# Altium project Extension_Board.PrjPcb
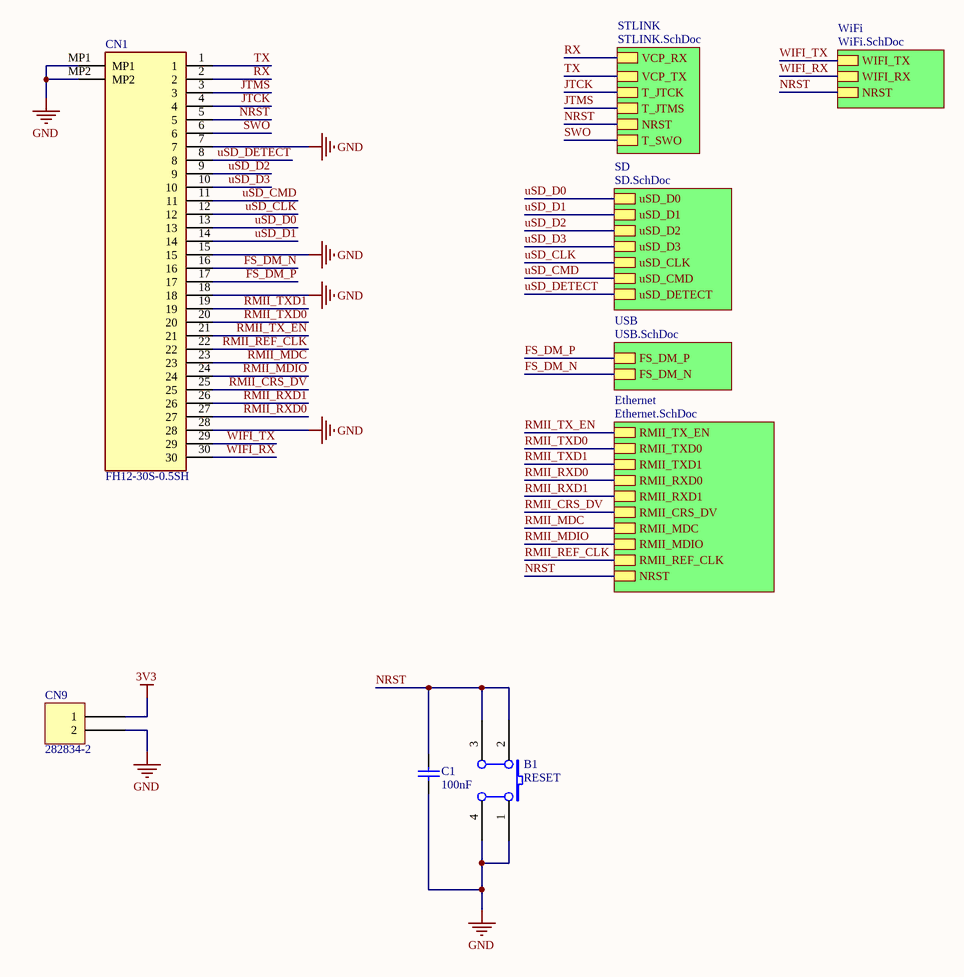
[diagram p0: Extension_Board.SchDoc]
6 sheets, 134 parts. Net scope: hierarchical (ports join the sheet entries above them; power ports are global).
Board files: PCB.PcbDoc, PCB_Auto.PcbDoc
Sheets:
  Extension_Board.SchDoc
    STLINK = STLINK.SchDoc
    SD = SD.SchDoc
    USB = USB.SchDoc
    Ethernet = Ethernet.SchDoc
    WiFi = WiFi.SchDoc

## Sheet Extension_Board.SchDoc
size B

### Parts
B1  RESET  [PB-6X6mm-Blue]
C1  value 100nF  [1608[0603]]  (hidden comment: Cap)
CN1  FH12-30S-0.5SH  [FH1230S05SH]
CN9  282834-2  [TE 282834-2]

### Sub-sheets
Ethernet = Ethernet.SchDoc: RMII_TX_EN, RMII_TXD0, RMII_TXD1, RMII_RXD0, RMII_RXD1, RMII_CRS_DV, RMII_MDC, RMII_MDIO, RMII_REF_CLK, NRST
SD = SD.SchDoc: uSD_D0, uSD_D1, uSD_D2, uSD_D3, uSD_CLK, uSD_CMD, uSD_DETECT
STLINK = STLINK.SchDoc: VCP_RX, VCP_TX, T_JTCK, T_JTMS, NRST, T_SWO
USB = USB.SchDoc: FS_DM_P, FS_DM_N
WiFi = WiFi.SchDoc: WIFI_TX, WIFI_RX, NRST

### Nets
3V3: CN9.1
GND: B1.1(A0) B1.4(A1) C1.2 CN1.7 CN1.15 CN1.18 CN1.28 CN1.MP1 CN1.MP2 CN9.2
FS_DM_N: CN1.16 ; sheet USB/FS_DM_N
FS_DM_P: CN1.17 ; sheet USB/FS_DM_P
JTCK: CN1.4 ; sheet STLINK/T_JTCK
JTMS: CN1.3 ; sheet STLINK/T_JTMS
NRST: B1.2(B0) B1.3(B1) C1.1 CN1.5 ; sheet STLINK/NRST, sheet Ethernet/NRST, sheet WiFi/NRST
RMII_CRS_DV: CN1.25 ; sheet Ethernet/RMII_CRS_DV
RMII_MDC: CN1.23 ; sheet Ethernet/RMII_MDC
RMII_MDIO: CN1.24 ; sheet Ethernet/RMII_MDIO
RMII_REF_CLK: CN1.22 ; sheet Ethernet/RMII_REF_CLK
RMII_RXD0: CN1.27 ; sheet Ethernet/RMII_RXD0
RMII_RXD1: CN1.26 ; sheet Ethernet/RMII_RXD1
RMII_TX_EN: CN1.21 ; sheet Ethernet/RMII_TX_EN
RMII_TXD0: CN1.20 ; sheet Ethernet/RMII_TXD0
RMII_TXD1: CN1.19 ; sheet Ethernet/RMII_TXD1
RX: CN1.2 ; sheet STLINK/VCP_RX
SWO: CN1.6 ; sheet STLINK/T_SWO
TX: CN1.1 ; sheet STLINK/VCP_TX
uSD_CLK: CN1.12 ; sheet SD/uSD_CLK
uSD_CMD: CN1.11 ; sheet SD/uSD_CMD
uSD_D0: CN1.13 ; sheet SD/uSD_D0
uSD_D1: CN1.14 ; sheet SD/uSD_D1
uSD_D2: CN1.9 ; sheet SD/uSD_D2
uSD_D3: CN1.10 ; sheet SD/uSD_D3
uSD_DETECT: CN1.8 ; sheet SD/uSD_DETECT
WIFI_RX: CN1.30 ; sheet WiFi/WIFI_RX  [project net RXD0]
WIFI_TX: CN1.29 ; sheet WiFi/WIFI_TX  [project net TXD0]

### Library data of the parts
B1 = SW PUSHBUTTON: SE PUSHBUTTON
C1 = Cap: Capacitor; Published: 8-Jun-2000; LatestRevisionDate: 17-Jul-2002; LatestRevisionNote: Re-released for DXP Platform.; PackageReference: RAD-0.3; Publisher: Altium Limited; PackageDescription: Radial Cap, Thru-Hole; 2 Leads; 0.3 in Pin Spacing
CN1 = FH12-30S-0.5SH: Connector; Manufacturer_Name: Hirose; Datasheet Link: https://datasheet.datasheetarchive.com/originals/dk/DKDS-2/23451.pdf; Height: 4.8mm; Manufacturer_Part_Number: FH12-30S-0.5SH
CN9 = 282834-2: TERM BLK 2P SIDE ENT 2.54MM PCB; Manufacturer: TE Connectivity AMP Connectors; Current: 10A; Mating Orientation: Horizontal with Board; Number of Levels: 1; Pitch: 0.100" (2.54mm); Positions Per Level: 2; Voltage: 150V; Wire Gauge: 16-30 AWG; Wire Termination: Screw - Rising Cage Clamp; Part Number: 282834-2; Color: Green; ComponentLink1Description: Datasheet; ComponentLink1URL: https://www.te.com/commerce/DocumentDelivery/DDEController?Action=srchrtrv&DocNm=282834&DocType=Customer+Drawing&DocLang=English; ComponentLink2Description: DigiKey Link; ComponentLink2URL: http://digikey.com/product-detail/en/te-connectivity-amp-connectors/282834-2/A98333-ND/1150135; LastUpdated: 1/15/2020 4:15:38 AM; Lifecycle Status: Active; Minimum Order: 1; Mounting Type: Through Hole; Packaging: Bulk; Part Status: Active; Price: 0.88; Series: Buchanan; Supplier 1: DigiKey; Supplier Part Number 1: A98333-ND

## Sheet STLINK.SchDoc
size B
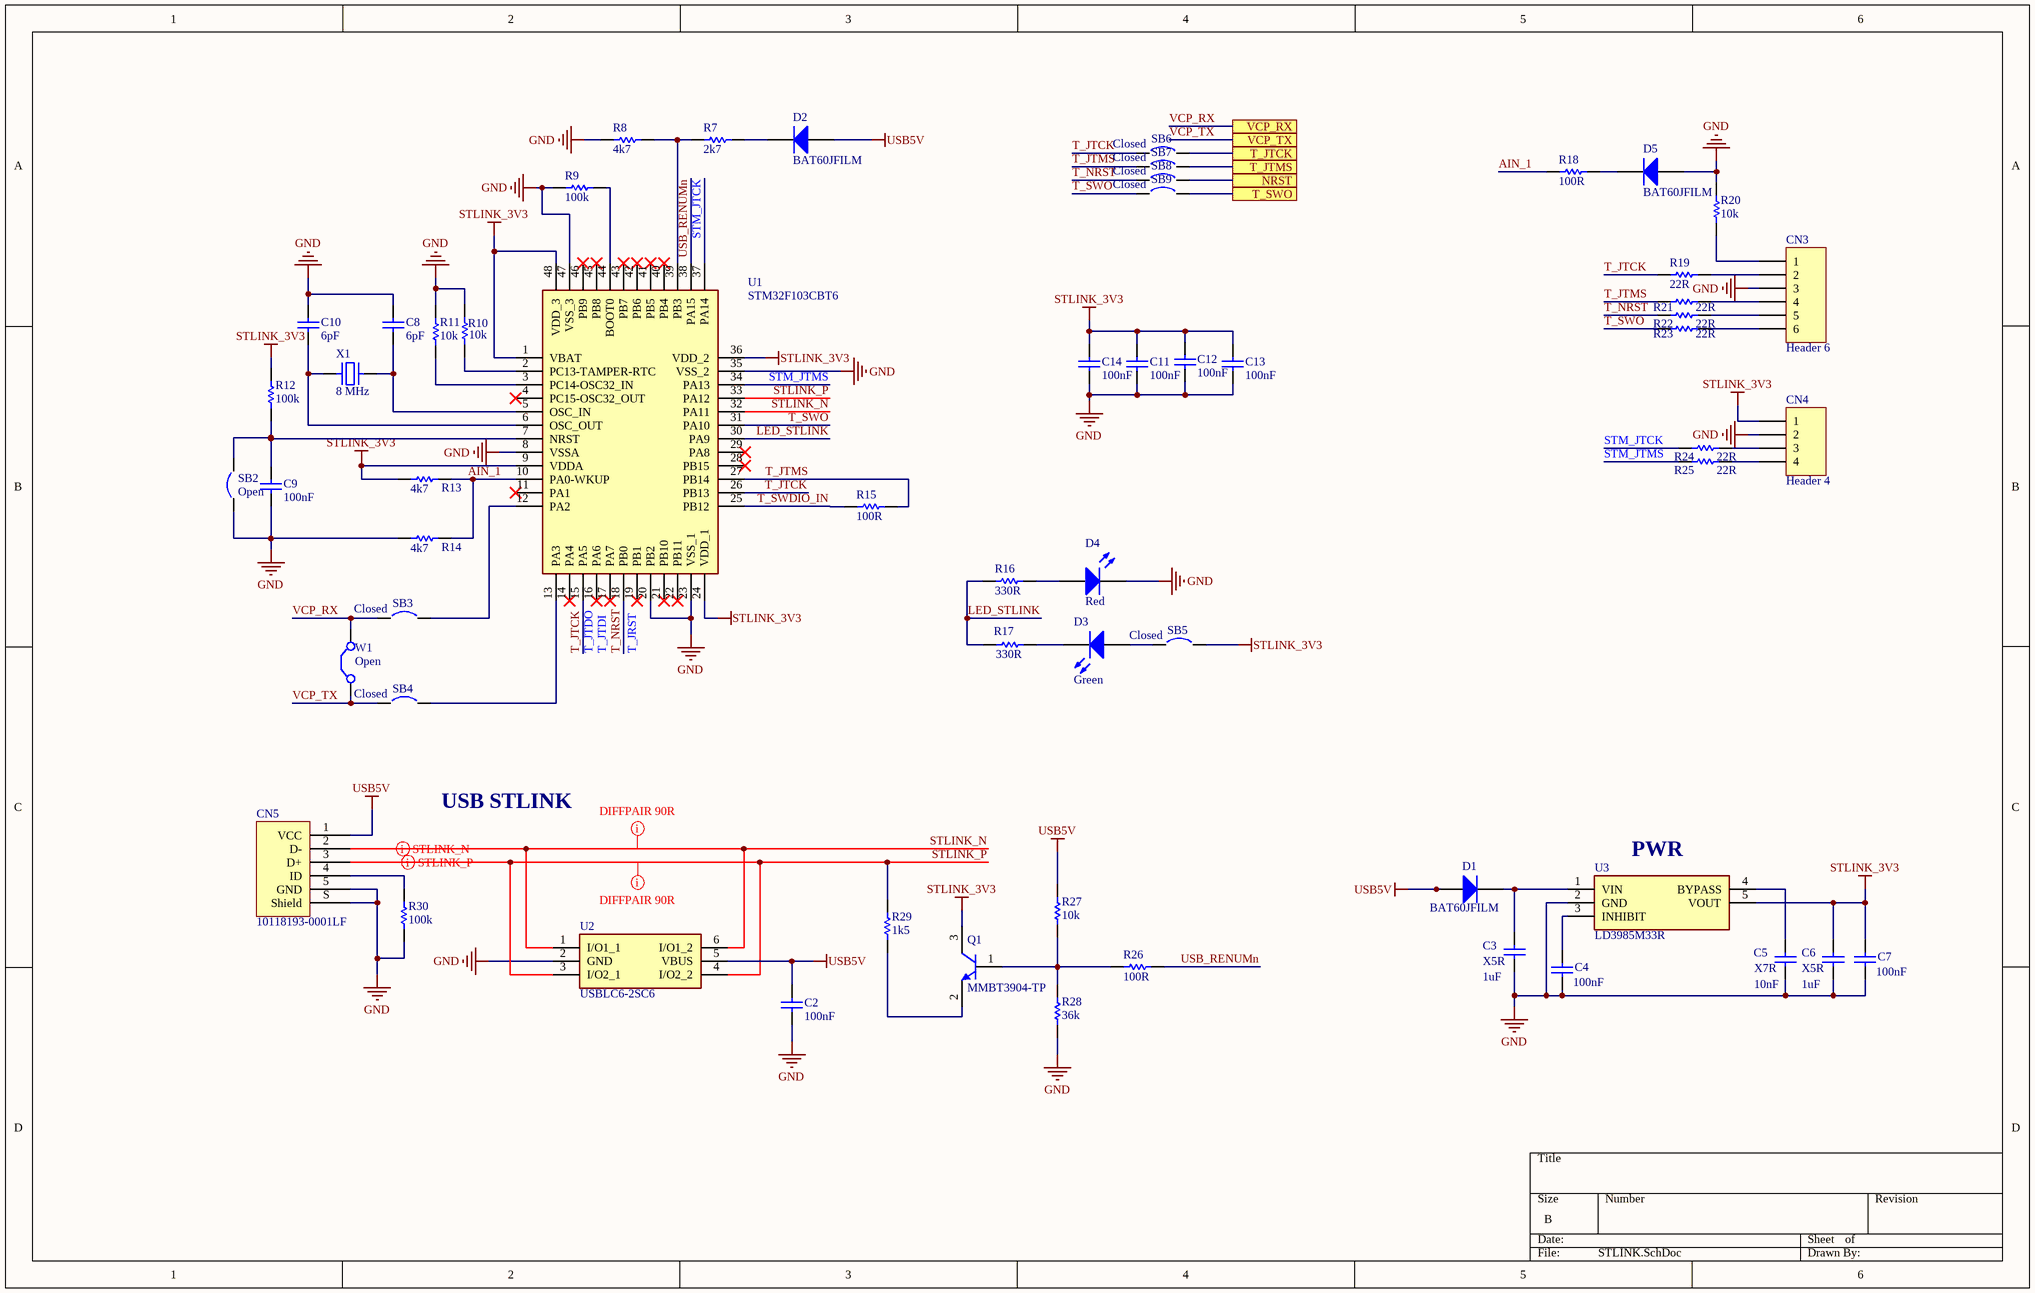
[diagram p1: STLINK.SchDoc]

### Parts
C2  value 100nF  [1608[0603]]  (hidden comment: Cap)
C3  X5R  value 1uF  [1608[0603]]
C4  value 100nF  [1608[0603]]  (hidden comment: X5R)
C5  X7R  value 10nF  [1608[0603]]
C6  X5R  value 1uF  [1608[0603]]
C7  value 100nF  [1608[0603]]  (hidden comment: X5R)
C8  value 6pF  [1608[0603]]  (hidden comment: Cap)
C9  value 100nF  [1608[0603]]  (hidden comment: Cap)
C10  value 6pF  [1608[0603]]  (hidden comment: Cap)
C11  value 100nF  [1608[0603]]  (hidden comment: Cap)
C12  value 100nF  [1608[0603]]  (hidden comment: Cap)
C13  value 100nF  [1608[0603]]  (hidden comment: Cap)
C14  value 100nF  [1608[0603]]  (hidden comment: Cap)
CN3  Header 6  [HDR1X6]
CN4  Header 4  [HDR1X4]
CN5  10118193-0001LF  [FCI USB 10118193-0001LF]
D1  BAT60JFILM  [C0805]
D2  BAT60JFILM  [C0805]
D3  Green  [1608[0603]]
D4  Red  [1608[0603]]
D5  BAT60JFILM  [C0805]
Q1  MMBT3904-TP  [MCCSEMI SOT-23-3]
R7  value 2k7  [1608[0603]]  (hidden comment: Res1)
R8  value 4k7  [1608[0603]]  (hidden comment: Res1)
R9  value 100k  [1608[0603]]  (hidden comment: Res1)
R10  value 10k  [1608[0603]]  (hidden comment: Res1)
R11  value 10k  [1608[0603]]  (hidden comment: Res1)
R12  value 100k  [1608[0603]]  (hidden comment: Res1)
R13  value 4k7  [1608[0603]]  (hidden comment: Res1)
R14  value 4k7  [1608[0603]]  (hidden comment: Res1)
R15  value 100R  [1608[0603]]  (hidden comment: Res1)
R16  value 330R  [1608[0603]]  (hidden comment: Res1)
R17  value 330R  [1608[0603]]  (hidden comment: Res1)
R18  value 100R  [1608[0603]]  (hidden comment: Res1)
R19  value 22R  [1608[0603]]  (hidden comment: Res1)
R20  value 10k  [1608[0603]]  (hidden comment: Res1)
R21  value 22R  [1608[0603]]  (hidden comment: Res1)
R22  value 22R  [1608[0603]]  (hidden comment: Res1)
R23  value 22R  [1608[0603]]  (hidden comment: Res1)
R24  value 22R  [1608[0603]]  (hidden comment: Res1)
R25  value 22R  [1608[0603]]  (hidden comment: Res1)
R26  value 100R  [1608[0603]]  (hidden comment: Res1)
R27  value 10k  [1608[0603]]  (hidden comment: Res1)
R28  value 36k  [1608[0603]]  (hidden comment: Res1)
R29  value 1k5  [1608[0603]]  (hidden comment: Res1)
R30  value 100k  [1608[0603]]  (hidden comment: Res1)
SB2  Open  [SB_0603]
SB3  Closed  [SB_0603]
SB4  Closed  [SB_0603]
SB5  Closed  [SB_0603]
SB6  Closed  [SB_0603]
SB7  Closed  [SB_0603]
SB8  Closed  [SB_0603]
SB9  Closed  [SB_0603]
U1  STM32F103CBT6  [QFP50P900X900X160-48N]
U2  USBLC6-2SC6  [SOT95P280X145-6N]
U3  LD3985M33R  [SOT95P280X145-5N]
W1  Open  [HDR1X2]
X1  8 MHz  [ECS CSM-3X]

### Ports
NRST, T_JTCK, T_JTMS, T_SWO, VCP_RX, VCP_TX

### Nets
GND: C2.1 C3.1 C4.2 C5.1 C6.1 C7.2 C8.2 C9.1 C10.2 C11.1 C12.1 C13.1 C14.1 CN3.3 CN4.2 CN5.5(GND) CN5.S(Shield) D4.2(K) D5.1(A) R8.2 R9.2 R10.2 R11.1 R14.2 R20.1 R28.1 R30.1 SB2.1 U1.8(VSSA) U1.20(PB2) U1.23(VSS_1) U1.35(VSS_2) U1.47(VSS_3) U2.2(GND) U3.2(GND)
STLINK_3V3: C6.2 C7.1 C11.2 C12.2 C13.2 C14.2 CN4.1 Q1.3(C) R12.2 R13.2 SB5.2 U1.1(VBAT) U1.9(VDDA) U1.24(VDD_1) U1.36(VDD_2) U1.48(VDD_3) U3.5(VOUT)
USB5V: C2.2 CN5.1(VCC) D1.1(A) D2.1(A) R27.2 U2.5(VBUS)
AIN_1: R13.1 R14.1 R18.1 U1.10(PA0-WKUP)
JTCK: SB6.2 ; port T_JTCK
JTMS: SB7.2 ; port T_JTMS
LED_STLINK: R16.2 R17.2 U1.30(PA9)
NRST: SB8.2 ; port NRST
STLINK_N: CN5.2(D-) U1.32(PA11) U2.1(I/O1_1) U2.6(I/O1_2)
STLINK_P: CN5.3(D+) R29.2 U1.33(PA12) U2.3(I/O2_1) U2.4(I/O2_2)
STM_JTCK: R24.1 U1.37(PA14)
STM_JTMS: R25.1 U1.34(PA13)
SWO: SB9.2 ; port T_SWO
T_JRST: R22.1 SB8.1 U1.18(PB0)  [also labelled T_NRST]
T_JTCK: R19.1 SB6.1 U1.15(PA5) U1.26(PB13)
T_JTMS: R15.1 R21.1 SB7.1 U1.27(PB14)
T_SWDIO_IN: R15.2 U1.25(PB12)
T_SWO: R23.1 SB9.1 U1.31(PA10)
USB_RENUMn: R26.1 U1.38(PA15)
VCP_RX: SB3.1 W1.2(C2) ; port VCP_RX  [project net RX]
VCP_TX: SB4.1 W1.1(C1) ; port VCP_TX  [project net TX]
NetC3_2: C3.2 D1.2(K) U3.1(VIN)
NetC4_1: C4.1 U3.3(INHIBIT)
NetC5_2: C5.2 U3.4(BYPASS)
NetC8_1: C8.1 U1.5(OSC_IN) X1.2
NetC9_2: C9.2 R12.1 SB2.2 U1.7(NRST)
NetC10_1: C10.1 U1.6(OSC_OUT) X1.1
NetCN3_1: CN3.1 R20.2
NetCN3_2: CN3.2 R19.2
NetCN3_4: CN3.4 R21.2
NetCN3_5: CN3.5 R22.2
NetCN3_6: CN3.6 R23.2
NetCN4_3: CN4.3 R24.2
NetCN4_4: CN4.4 R25.2
NetCN5_4: CN5.4(ID) R30.2
NetD2_2: D2.2(K) R7.1
NetD3_1: D3.1(A) SB5.1
NetD3_2: D3.2(K) R17.1
NetD4_1: D4.1(A) R16.1
NetD5_2: D5.2(K) R18.2
NetQ1_1: Q1.1(B) R26.2 R27.1 R28.2
NetQ1_2: Q1.2(E) R29.1
NetR7_2: R7.2 R8.1 U1.39(PB3)
NetR9_1: R9.1 U1.44(BOOT0)
NetR10_1: R10.1 U1.2(PC13-TAMPER-RTC)
NetR11_2: R11.2 U1.3(PC14-OSC32_IN)
NetSB3_2: SB3.2 U1.12(PA2)
NetSB4_2: SB4.2 U1.13(PA3)

Not connected (* = marked no-connect by the designer): U1 4(PC15-OSC32_OUT)* 11(PA1)* 14(PA4)* 16(PA6)* 17(PA7)* 19(PB1)* 21(PB10)* 22(PB11)* 28(PB15)* 29(PA8)* 40(PB4)* 41(PB5)* 42(PB6)* 43(PB7)* 45(PB8)* 46(PB9)*

### Layout directives
differential pair: STLINK_N, STLINK_P
mark named DIFFPAIR 90R: STLINK_N, STLINK_P

### Notes on the sheet
- USB STLINK
- (near U3) PWR
- Labels drawn without touching a wire or pin: T_JTDI, T_JTDO

### Library data of the parts
C2-C14 = Cap: Capacitor; Published: 8-Jun-2000; LatestRevisionDate: 17-Jul-2002; LatestRevisionNote: Re-released for DXP Platform.; PackageReference: RAD-0.3; Publisher: Altium Limited; PackageDescription: Radial Cap, Thru-Hole; 2 Leads; 0.3 in Pin Spacing
CN3 = Header 6: Header, 6-Pin; LatestRevisionDate: 17-Jul-2002; LatestRevisionNote: Re-released for DXP Platform.; Publisher: Altium Limited
CN4 = Header 4: Header, 4-Pin; LatestRevisionDate: 17-Jul-2002; LatestRevisionNote: Re-released for DXP Platform.; Publisher: Altium Limited
CN5 = 10118193-0001LF: CONN RCPT USB2.0 MICRO B SMD R/A; Manufacturer: Amphenol ICC (FCI); Connector Type: USB - micro B; Current Rating (Amps): 1.8A per Contact; Gender: Receptacle; Mating Cycles: 10000; Number of Contacts: 5; Number of Ports: 1; Shielding: Shielded; Voltage - Rated: 100VAC; Part Number: 10118193-0001LF; ComponentLink1Description: Datasheet; ComponentLink1URL: https://cdn.amphenol-icc.com/media/wysiwyg/files/documentation/datasheet/inputoutput/io_usb_micro.pdf; ComponentLink2Description: DigiKey Link; ComponentLink2URL: //digikey.com/product-detail/en/amphenol-icc-fci/10118193-0001LF/609-4616-2-ND/2785388; Features: Solder Retention; LastUpdated: 12/9/2019 8:51:28 PM; Lifecycle Status: 0; Minimum Order: 1; Mounting Feature: Horizontal; Mounting Type: Surface Mount, Right Angle; Through Hole; Operating Temperature: -30°C ~ 80°C; Packaging: TapeAndReel; Part Status: Active; Price: 0.21; Series: -; Specifications: USB 2.0; Supplier 1: DigiKey; Supplier Part Number 1: 609-4616-2-ND; Termination: Solder
D1 D2 D5 = Diode: Default Diode; Published: 8-Jun-2000; LatestRevisionDate: 17-Jul-2002; LatestRevisionNote: Re-released for DXP Platform.; PackageVersion: Sep-1996; PackageReference: SMC; Publisher: Altium Limited; PackageDescription: DO-214-AB/SMC; 2 C-Bend Leads; Body 7.9 x 5.9 mm, inc. leads (LxW); Code_JEDEC: DO-214-AB
D3 D4 = LED3: Typical BLUE SiC LED; Published: 8-Jun-2000; LatestRevisionDate: 17-Dec-2003; LatestRevisionNote: PCB Footprint replaced.; DatasheetVersion: 16-Apr-2002; PackageVersion: 16-Apr-2002; PackageReference: 3.5X2.8X1.9; Publisher: Altium Limited; PackageDescription: SM LED; 2 C-Bend Leads; Body 3.5 x 2.8 x 1.9 mm, inc leads (LxWxH typ)
Q1 = MMBT3904-TP: TRANS NPN 40V 0.2A SOT23; Manufacturer: Micro Commercial Co; Current - Collector Cutoff (Max): 50nA (ICBO); Current - Collector (Ic) (Max): 200 mA; DC Current Gain (hFE) (Min) @ Ic, Vce: 100 @ 10mA, 1V; Frequency - Transition: 300MHz; Power - Max: 350 mW; Vce Saturation (Max) @ Ib, Ic: 300mV @ 5mA, 50mA; Part Number: MMBT3904-TP; ComponentLink1Description: Datasheet; ComponentLink1URL: https://www.mccsemi.com/pdf/Products/MMBT3904(SOT-23).pdf; ComponentLink2Description: DigiKey Link; ComponentLink2URL: https://www.digikey.com/en/products/detail/micro-commercial-co/MMBT3904-TP/717280; LastUpdated: 2/3/2023 9:11:21 PM; Lifecycle Status: Active; Minimum Order: 1; Mounting Type: Surface Mount; Operating Temperature: -55°C ~ 150°C (TJ); Package / Case: TO-236-3, SC-59, SOT-23-3; Packaging: TapeAndReel; PartId: 260; Part Status: Active; Price: 0.01; Series: -; Supplier 1: DigiKey; Supplier Part Number 1: MMBT3904TPMSCT-ND; Supplier Device Package: SOT-23; Transistor Type: NPN; Voltage - Collector Emitter Breakdown (Max): 40 V
R7-R30 = Res1: Resistor; Published: 8-Jun-2000; LatestRevisionDate: 17-Jul-2002; LatestRevisionNote: Re-released for DXP Platform.; PackageReference: AXIAL-0.3; Publisher: Altium Limited; PackageDescription: Axial Device, Thru-Hole; 2 Leads; 0.3 in Pin Spacing
SB2-SB9 = Circuit Breaker: Published: 24-Mar-1999; Revision: July-2002: Re-released for DXP Platform.; Publisher: Altium Limited
U1 = STM32F103CBT6: Integrated Circuit; Manufacturer_Name: STMicroelectronics; Datasheet Link: http://www.st.com/st-web-ui/static/active/en/resource/technical/document/datasheet/CD00161566.pdf; Height: 1.6mm; Manufacturer_Part_Number: STM32F103CBT6; Mouser Part Number: 511-STM32F103CBT6; Mouser Price/Stock: https://www.mouser.co.uk/ProductDetail/STMicroelectronics/STM32F103CBT6?qs=WxFF5lh7QM3goh6GV5Ogig%3D%3D; Arrow Part Number: STM32F103CBT6; Arrow Price/Stock: https://www.arrow.com/en/products/stm32f103cbt6/stmicroelectronics?region=europe
U2 = USBLC6-2SC6: Integrated Circuit; Manufacturer_Name: STMicroelectronics; Datasheet Link: http://www.st.com/st-web-ui/static/active/en/resource/technical/document/datasheet/CD00050750.pdf; Height: 1.45mm; Manufacturer_Part_Number: USBLC6-2SC6; Mouser Part Number: 511-USBLC6-2SC6; Mouser Price/Stock: https://www.mouser.co.uk/ProductDetail/STMicroelectronics/USBLC6-2SC6?qs=po45yt2pPpu%2FhNIlwQdTlg%3D%3D; Arrow Part Number: USBLC6-2SC6; Arrow Price/Stock: https://www.arrow.com/en/products/usblc6-2sc6/stmicroelectronics?region=nac
U3 = LD3985M33R: Integrated Circuit; Manufacturer_Name: STMicroelectronics; Datasheet Link: http://www.st.com/st-web-ui/static/active/en/resource/technical/document/datasheet/CD00003395.pdf; Height: 1.45mm; Manufacturer_Part_Number: LD3985M33R; Mouser Part Number: 511-LD3985M33R; Mouser Price/Stock: https://www.mouser.co.uk/ProductDetail/STMicroelectronics/LD3985M33R?qs=22WmWNTp1rrPOccVv4HZ7A%3D%3D; Arrow Part Number: LD3985M33R; Arrow Price/Stock: https://www.arrow.com/en/products/ld3985m33r/stmicroelectronics?region=nac
W1 = Jumper: Jumper Wire; Published: 24-Mar-1999; LatestRevisionDate: 17-Jul-2002; LatestRevisionNote: Re-released for DXP Platform.; PackageReference: RAD-0.2; Publisher: Altium Limited; PackageDescription: Radial Cap, Thru-Hole; 2 Leads; 0.2 in Pin Spacing
X1 = ECS-120-20-3X-EN-TR: CRYSTAL 12.0000MHZ 20PF SMD; Manufacturer: ECS Inc.; ESR (Equivalent Series Resistance): 60 Ohms; Frequency: 12 MHz; Frequency Stability: ±50ppm; Frequency Tolerance: ±30ppm; Operating Mode: Fundamental; Value: 12 MHz; Part Number: ECS-120-20-3X-EN-TR; ComponentLink1Description: Datasheet; ComponentLink1URL: http://www.ecsxtal.com/store/pdf/CSM-3X.pdf; ComponentLink2Description: DigiKey Link; ComponentLink2URL: https://www.digikey.com/en/products/detail/ecs-inc/ECS-120-20-3X-EN-TR/2676617; Height - Seated (Max): 0.091" (2.30mm); LastUpdated: 2/3/2023 8:57:34 PM; Lifecycle Status: Active; Load Capacitance: 20pF; Minimum Order: 1; Mounting Type: Surface Mount; Operating Temperature: -40°C ~ 85°C; Package / Case: HC-49/US; Packaging: TapeAndReel; PartId: 407; Part Status: Active; Price: 0.23; Series: CSM-3X; Size / Dimension: 0.276" L x 0.161" W (7.00mm x 4.10mm); Supplier 1: DigiKey; Supplier Part Number 1: XC1787CT-ND; Type: MHz Crystal

## Sheet SD.SchDoc
size B
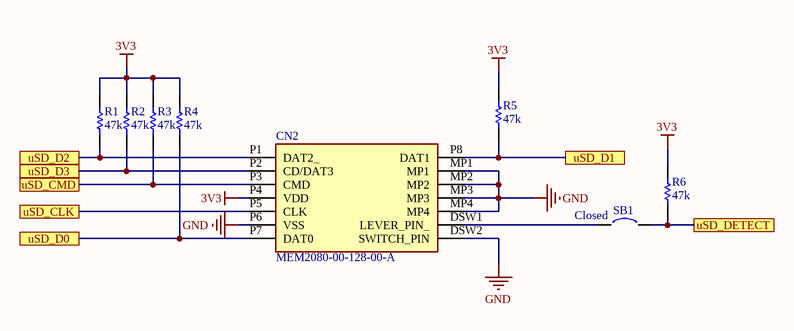
[diagram p2: SD.SchDoc]

### Parts
CN2  MEM2080-00-128-00-A  [MEM20800012800A]
R1  value 47k  [1608[0603]]  (hidden comment: Res1)
R2  value 47k  [1608[0603]]  (hidden comment: Res1)
R3  value 47k  [1608[0603]]  (hidden comment: Res1)
R4  value 47k  [1608[0603]]  (hidden comment: Res1)
R5  value 47k  [1608[0603]]  (hidden comment: Res1)
R6  value 47k  [1608[0603]]  (hidden comment: Res1)
SB1  Closed  [SB_0603]

### Ports
uSD_CLK, uSD_CMD, uSD_D0, uSD_D1, uSD_D2, uSD_D3, uSD_DETECT

### Nets
3V3: CN2.P4(VDD) R1.1 R2.1 R3.1 R4.1 R5.1 R6.2
GND: CN2.DSW2(SWITCH_PIN) CN2.MP1 CN2.MP2 CN2.MP3 CN2.MP4 CN2.P6(VSS)
uSD_CLK: CN2.P5(CLK) ; port uSD_CLK
uSD_CMD: CN2.P3(CMD) R3.2 ; port uSD_CMD
uSD_D0: CN2.P7(DAT0) R4.2 ; port uSD_D0
uSD_D1: CN2.P8(DAT1) R5.2 ; port uSD_D1
uSD_D2: CN2.P1(DAT2_) R1.2 ; port uSD_D2
uSD_D3: CN2.P2(CD/DAT3) R2.2 ; port uSD_D3
uSD_DETECT: R6.1 SB1.2 ; port uSD_DETECT
NetCN2_DSW1: CN2.DSW1(LEVER_PIN_) SB1.1

### Library data of the parts
CN2 = MEM2080-00-128-00-A: Connector; Manufacturer_Name: GCT (GLOBAL CONNECTOR TECHNOLOGY); Datasheet Link: https://gct.co/newark/connector/MEM2080; Height: 1.48mm; Manufacturer_Part_Number: MEM2080-00-128-00-A; Mouser Part Number: 640-MEM2080-0012800A; Mouser Price/Stock: https://www.mouser.co.uk/ProductDetail/GCT/MEM2080-00-128-00-A?qs=vvQtp7zwQdPJXzpf1SnYug%3D%3D
R1-R6 = Res1: Resistor; Published: 8-Jun-2000; LatestRevisionDate: 17-Jul-2002; LatestRevisionNote: Re-released for DXP Platform.; PackageReference: AXIAL-0.3; Publisher: Altium Limited; PackageDescription: Axial Device, Thru-Hole; 2 Leads; 0.3 in Pin Spacing
SB1 = Circuit Breaker: Published: 24-Mar-1999; Revision: July-2002: Re-released for DXP Platform.; Publisher: Altium Limited

## Sheet USB.SchDoc
size B
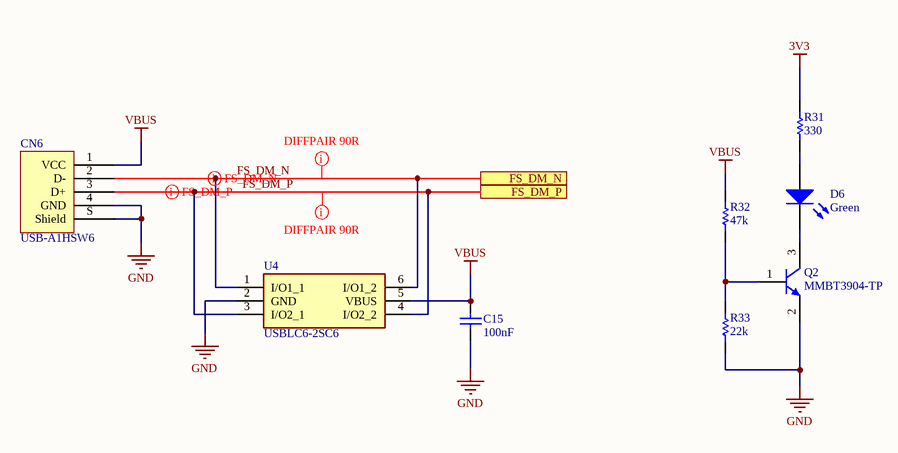
[diagram p3: USB.SchDoc]

### Parts
C15  value 100nF  [1608[0603]]  (hidden comment: Cap)
CN6  USB-A1HSW6  [ON SHORE TECHNOLOGY USB-A1HSW6]
D6  Green  [1608[0603]]
Q2  MMBT3904-TP  [MCCSEMI SOT-23-3]
R31  value 330  [1608[0603]]  (hidden comment: Res1)
R32  value 47k  [1608[0603]]  (hidden comment: Res1)
R33  value 22k  [1608[0603]]  (hidden comment: Res1)
U4  USBLC6-2SC6  [SOT95P280X145-6N]

### Ports
FS_DM_N, FS_DM_P

### Nets
3V3: R31.2
GND: C15.1 CN6.4(GND) CN6.S(Shield) Q2.2(E) R33.1 U4.2(GND)
VBUS: C15.2 CN6.1(VCC) R32.2 U4.5(VBUS)
FS_DM_N: CN6.2(D-) U4.1(I/O1_1) U4.6(I/O1_2) ; port FS_DM_N
FS_DM_P: CN6.3(D+) U4.3(I/O2_1) U4.4(I/O2_2) ; port FS_DM_P
NetD6_1: D6.1(A) R31.1
NetD6_2: D6.2(K) Q2.3(C)
NetQ2_1: Q2.1(B) R32.1 R33.2

### Layout directives
differential pair: FS_DM_N, FS_DM_P
mark named DIFFPAIR 90R: FS_DM_N, FS_DM_P

### Library data of the parts
C15 = Cap: Capacitor; Published: 8-Jun-2000; LatestRevisionDate: 17-Jul-2002; LatestRevisionNote: Re-released for DXP Platform.; PackageReference: RAD-0.3; Publisher: Altium Limited; PackageDescription: Radial Cap, Thru-Hole; 2 Leads; 0.3 in Pin Spacing
CN6 = USB-A1HSW6: CONN RCPT TYPEA 4POS R/A; Manufacturer: On Shore Technology Inc.; Connector Type: USB - A; Current Rating (Amps): 1A; Gender: Receptacle; Number of Contacts: 4; Number of Ports: 1; Shielding: Unshielded; Voltage - Rated: 30VAC; Part Number: USB-A1HSW6; ComponentLink1Description: Datasheet; ComponentLink1URL: http://www.on-shore.com/wp-content/uploads/USB-A1HSXX.pdf; ComponentLink2Description: DigiKey Link; ComponentLink2URL: http://digikey.com/product-detail/en/on-shore-technology-inc/USB-A1HSW6/ED2989-ND/2677750; Features: Board Lock; LastUpdated: 4/30/2020 11:56:44 AM; Lifecycle Status: Active; Minimum Order: 1; Mounting Feature: Horizontal; Mounting Type: Through Hole, Right Angle; Operating Temperature: 0°C ~ 85°C; Packaging: Tray; Part Status: Active; Price: 0.48; Series: -; Supplier 1: DigiKey; Supplier Part Number 1: ED2989-ND; Termination: Solder
D6 = LED3: Typical BLUE SiC LED; Published: 8-Jun-2000; LatestRevisionDate: 17-Dec-2003; LatestRevisionNote: PCB Footprint replaced.; DatasheetVersion: 16-Apr-2002; PackageVersion: 16-Apr-2002; PackageReference: 3.5X2.8X1.9; Publisher: Altium Limited; PackageDescription: SM LED; 2 C-Bend Leads; Body 3.5 x 2.8 x 1.9 mm, inc leads (LxWxH typ)
Q2 = MMBT3904-TP: as Q1 on sheet STLINK; Part Number: MMBT3904-TP; ComponentLink1Description: Datasheet; ComponentLink1URL: https://www.mccsemi.com/pdf/Products/MMBT3904(SOT-23).pdf; ComponentLink2Description: DigiKey Link; ComponentLink2URL: https://www.digikey.com/en/products/detail/micro-commercial-co/MMBT3904-TP/717280; LastUpdated: 2/3/2023 9:11:21 PM; Lifecycle Status: Active; Minimum Order: 1; Mounting Type: Surface Mount; Operating Temperature: -55°C ~ 150°C (TJ); Package / Case: TO-236-3, SC-59, SOT-23-3; Packaging: TapeAndReel; PartId: 260; Part Status: Active; Price: 0.01; Series: -; Supplier 1: DigiKey; Supplier Part Number 1: MMBT3904TPMSCT-ND; Supplier Device Package: SOT-23; Transistor Type: NPN; Voltage - Collector Emitter Breakdown (Max): 40 V
R31-R33 = Res1: Resistor; Published: 8-Jun-2000; LatestRevisionDate: 17-Jul-2002; LatestRevisionNote: Re-released for DXP Platform.; PackageReference: AXIAL-0.3; Publisher: Altium Limited; PackageDescription: Axial Device, Thru-Hole; 2 Leads; 0.3 in Pin Spacing
U4 = USBLC6-2SC6: as U2 on sheet STLINK; Datasheet Link: http://www.st.com/st-web-ui/static/active/en/resource/technical/document/datasheet/CD00050750.pdf; Height: 1.45mm; Manufacturer_Part_Number: USBLC6-2SC6; Mouser Part Number: 511-USBLC6-2SC6; Mouser Price/Stock: https://www.mouser.co.uk/ProductDetail/STMicroelectronics/USBLC6-2SC6?qs=po45yt2pPpu%2FhNIlwQdTlg%3D%3D; Arrow Part Number: USBLC6-2SC6; Arrow Price/Stock: https://www.arrow.com/en/products/usblc6-2sc6/stmicroelectronics?region=nac

## Sheet Ethernet.SchDoc
size B
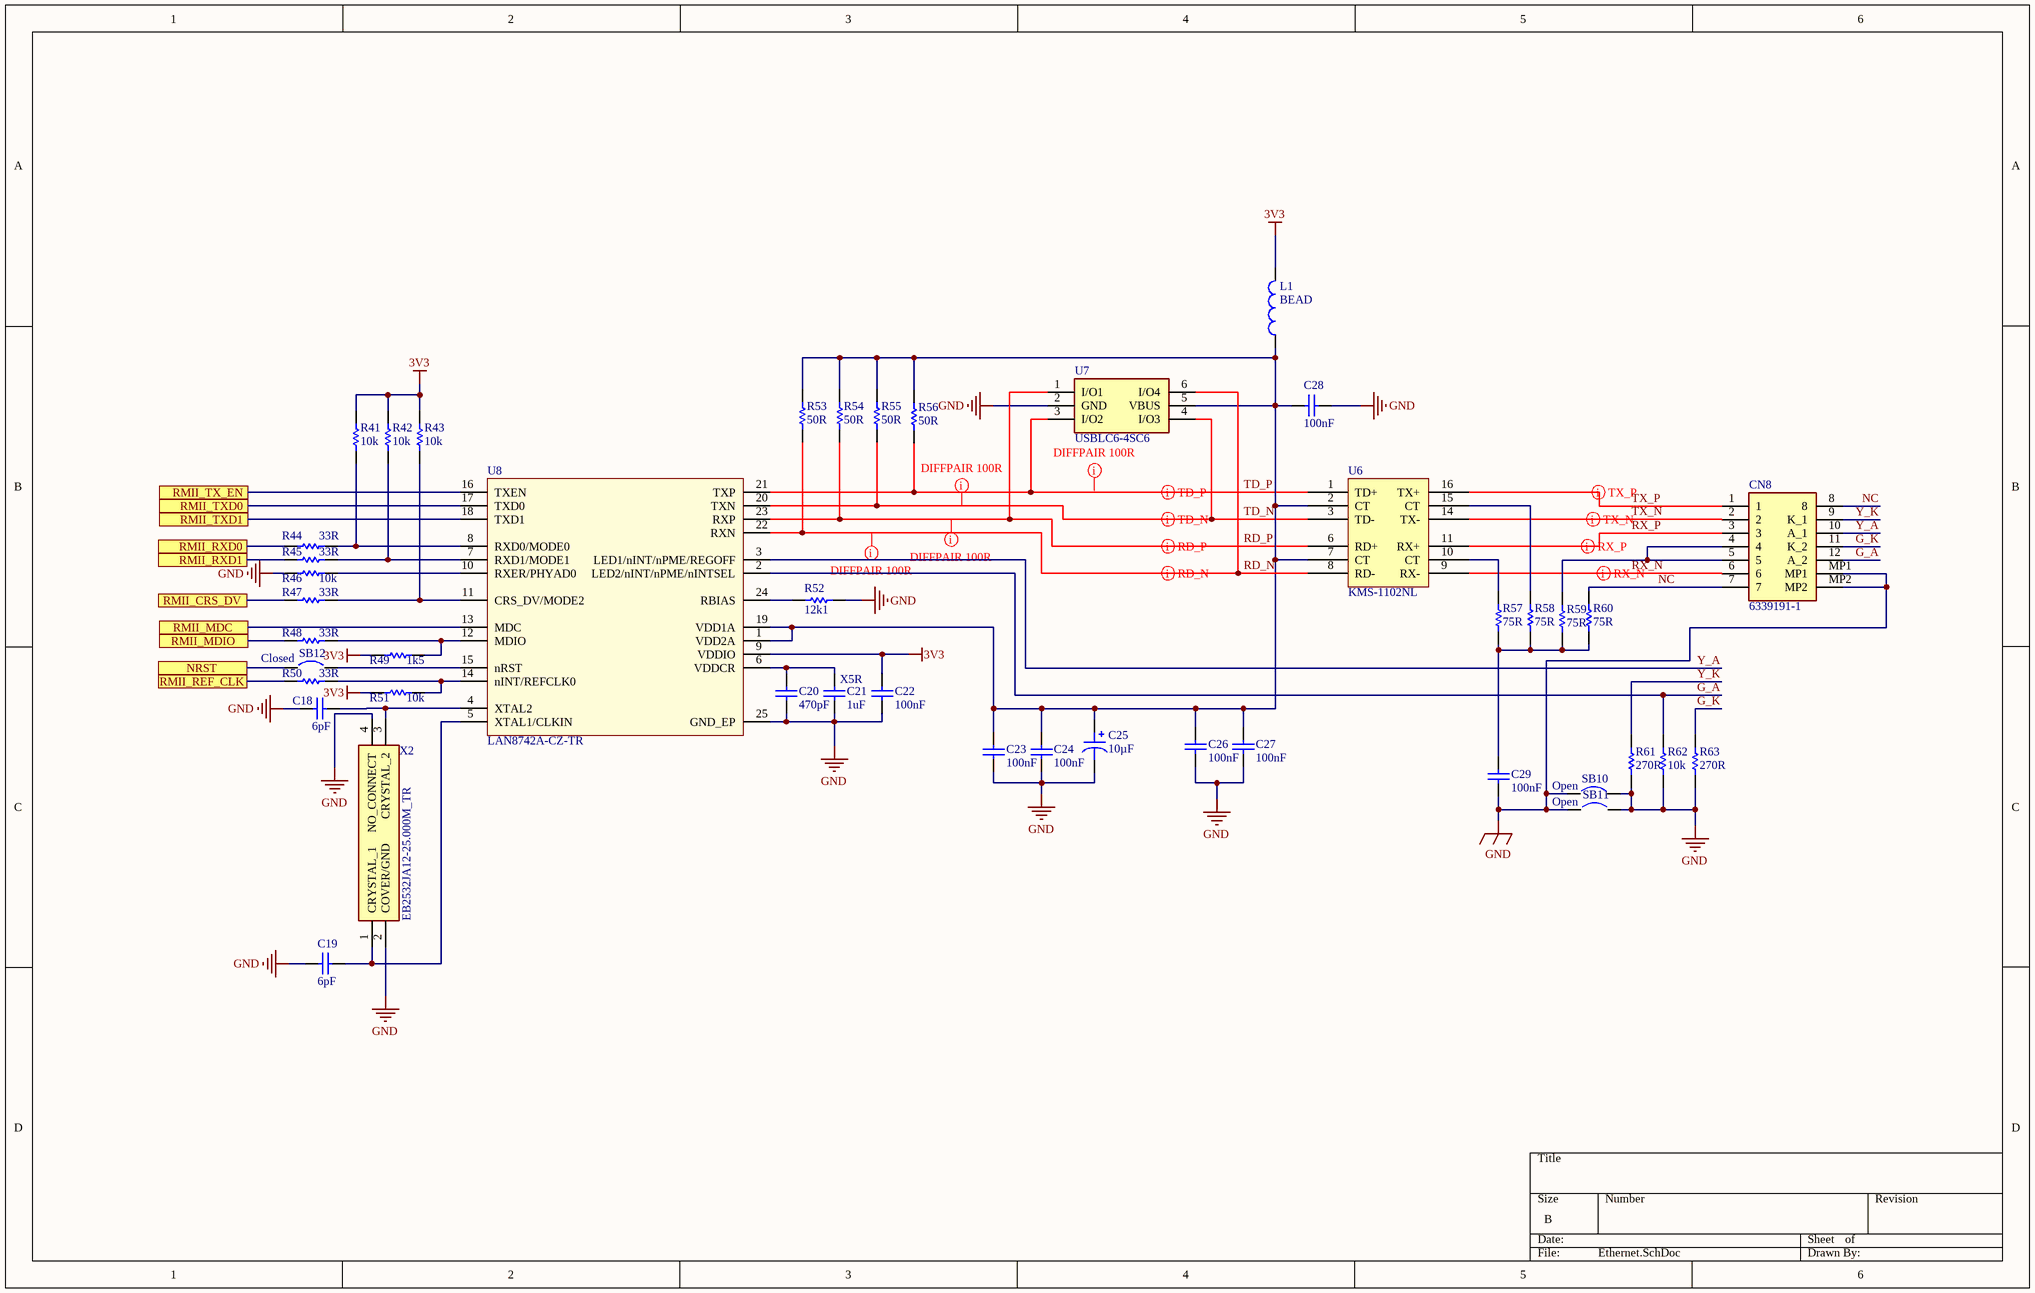
[diagram p4: Ethernet.SchDoc]

### Parts
C18  value 6pF  [1608[0603]]  (hidden comment: Cap)
C19  value 6pF  [1608[0603]]  (hidden comment: Cap)
C20  value 470pF  [1608[0603]]  (hidden comment: Cap)
C21  X5R  value 1uF  [1608[0603]]
C22  value 100nF  [1608[0603]]  (hidden comment: Cap)
C23  value 100nF  [1608[0603]]  (hidden comment: Cap)
C24  value 100nF  [1608[0603]]  (hidden comment: Cap)
C25  10µF  [CAP ALSMD 5.3MM H5.4MM]
C26  value 100nF  [1608[0603]]  (hidden comment: Cap)
C27  value 100nF  [1608[0603]]  (hidden comment: Cap)
C28  value 100nF  [1608[0603]]  (hidden comment: Cap)
C29  value 100nF  [1608[0603]]  (hidden comment: Cap)
CN8  6339191-1  [63391911]
L1  BEAD  [0603L]
R41  value 10k  [1608[0603]]  (hidden comment: Res1)
R42  value 10k  [1608[0603]]  (hidden comment: Res1)
R43  value 10k  [1608[0603]]  (hidden comment: Res1)
R44  value 33R  [1608[0603]]  (hidden comment: Res1)
R45  value 33R  [1608[0603]]  (hidden comment: Res1)
R46  value 10k  [1608[0603]]  (hidden comment: Res1)
R47  value 33R  [1608[0603]]  (hidden comment: Res1)
R48  value 33R  [1608[0603]]  (hidden comment: Res1)
R49  value 1k5  [1608[0603]]  (hidden comment: Res1)
R50  value 33R  [1608[0603]]  (hidden comment: Res1)
R51  value 10k  [1608[0603]]  (hidden comment: Res1)
R52  value 12k1  [1608[0603]]  (hidden comment: Res1)
R53  value 50R  [1608[0603]]  (hidden comment: Res1)
R54  value 50R  [1608[0603]]  (hidden comment: Res1)
R55  value 50R  [1608[0603]]  (hidden comment: Res1)
R56  value 50R  [1608[0603]]  (hidden comment: Res1)
R57  value 75R  [1608[0603]]  (hidden comment: Res1)
R58  value 75R  [1608[0603]]  (hidden comment: Res1)
R59  value 75R  [1608[0603]]  (hidden comment: Res1)
R60  value 75R  [1608[0603]]  (hidden comment: Res1)
R61  value 270R  [1608[0603]]  (hidden comment: Res1)
R62  value 10k  [1608[0603]]  (hidden comment: Res1)
R63  value 270R  [1608[0603]]  (hidden comment: Res1)
SB10  Open  [SB_0603]
SB11  Open  [SB_0603]
SB12  Closed  [SB_0603]
U6  KMS-1102NL  [Transformer]
U7  USBLC6-4SC6  [SOT95P280X145-6N]
U8  LAN8742A-CZ-TR  [QFN24_0R5_4X4]
X2  EB2532JA12-25.000M_TR  [EB2532JA1225000MTR]

### Ports
NRST, RMII_CRS_DV, RMII_MDC, RMII_MDIO, RMII_REF_CLK, RMII_RXD0, RMII_RXD1, RMII_TX_EN, RMII_TXD0, RMII_TXD1

### Nets
3V3: C22.1 L1.2 R41.2 R42.2 R43.2 R49.2 R51.2 U8.9(VDDIO)
GND: C18.1 C19.1 C20.2 C21.2 C22.2 C23.2 C24.2 C25.2 C26.2 C27.2 C28.1 C29.1 CN8.MP1 CN8.MP2 R46.2 R52.1 R61.1 R62.1 R63.1 SB10.1 SB10.2 SB11.1 SB11.2 U7.2(GND) U8.25(GND_EP) X2.2(COVER/GND) X2.4(NO_CONNECT)
G_A: CN8.12(A_2) R62.2 U8.2(LED2/nINT/nPME/nINTSEL)
G_K: CN8.11(K_2) R63.2
NC: CN8.7 CN8.8 R60.2
NRST: SB12.1 ; port NRST
RD_N: R53.1 U6.8(RD-) U7.6(I/O4) U8.22(RXN)
RD_P: R54.1 U6.6(RD+) U7.1(I/O1) U8.23(RXP)
RMII_CRS_DV: R47.2 ; port RMII_CRS_DV
RMII_MDC: U8.13(MDC) ; port RMII_MDC
RMII_MDIO: R48.2 ; port RMII_MDIO
RMII_REF_CLK: R50.2 ; port RMII_REF_CLK
RMII_RXD0: R44.2 ; port RMII_RXD0
RMII_RXD1: R45.2 ; port RMII_RXD1
RMII_TX_EN: U8.16(TXEN) ; port RMII_TX_EN
RMII_TXD0: U8.17(TXD0) ; port RMII_TXD0
RMII_TXD1: U8.18(TXD1) ; port RMII_TXD1
RX_N: CN8.6 U6.9(RX-)
RX_P: CN8.3 U6.11(RX+)
TD_N: R55.1 U6.3(TD-) U7.4(I/O3) U8.20(TXN)
TD_P: R56.1 U6.1(TD+) U7.3(I/O2) U8.21(TXP)
TX_N: CN8.2 U6.14(TX-)
TX_P: CN8.1 U6.16(TX+)
Y_A: CN8.10(A_1) U8.3(LED1/nINT/nPME/REGOFF)
Y_K: CN8.9(K_1) R61.2
NetC18_2: C18.2 U8.4(XTAL2) X2.3(CRYSTAL_2)
NetC19_2: C19.2 U8.5(XTAL1/CLKIN) X2.1(CRYSTAL_1)
NetC20_1: C20.1 C21.1 U8.6(VDDCR)
NetC23_1: C23.1 C24.1 C25.1 C26.1 C27.1 C28.2 L1.1 R53.2 R54.2 R55.2 R56.2 U6.2(CT) U6.7(CT) U7.5(VBUS) U8.1(VDD2A) U8.19(VDD1A)
NetC29_2: C29.2 R57.1 R58.1 R59.1 R60.1
NetCN8_4: CN8.4 CN8.5 R59.2
NetR41_1: R41.1 R44.1 U8.8(RXD0/MODE0)
NetR42_1: R42.1 R45.1 U8.7(RXD1/MODE1)
NetR43_1: R43.1 R47.1 U8.11(CRS_DV/MODE2)
NetR46_1: R46.1 U8.10(RXER/PHYAD0)
NetR48_1: R48.1 R49.1 U8.12(MDIO)
NetR50_1: R50.1 R51.1 U8.14(nINT/REFCLK0)
NetR52_2: R52.2 U8.24(RBIAS)
NetR57_2: R57.2 U6.10(CT)
NetR58_2: R58.2 U6.15(CT)
NetSB12_2: SB12.2 U8.15(nRST)

### Layout directives
differential pair: RD_N, RD_P, RX_N, RX_P, TD_N, TD_P, TX_N, TX_P
mark named DIFFPAIR 100R: (no net found under the mark), RD_N, RD_P, TD_N

### Library data of the parts
C18-C24 C26-C29 = Cap: Capacitor; Published: 8-Jun-2000; LatestRevisionDate: 17-Jul-2002; LatestRevisionNote: Re-released for DXP Platform.; PackageReference: RAD-0.3; Publisher: Altium Limited; PackageDescription: Radial Cap, Thru-Hole; 2 Leads; 0.3 in Pin Spacing
C25 = UZP1C100MCL1GB: CAP ALUM 10UF 20% 16V SMD; manufacturer: Nichicon; Lifetime @ Temp.: 2000 Hrs @ 85°C; Polarization: Bi-Polar; Ripple Current @ High Frequency: 34.5mA @ 10kHz; Ripple Current @ Low Frequency: 23mA @ 120Hz; Surface Mount Land Size: 0.209" L x 0.209" W (5.30mm x 5.30mm); Part Number: UZP1C100MCL1GB; Applications: General Purpose; Capacitance: 10µF; componentlink1description: Datasheet; componentlink1url: //media.digikey.com/pdf/Data%20Sheets/Nichicon%20PDFs/ZP_Series.pdf; componentlink2description: DigiKey Link; componentlink2url: http://digikey.com/product-detail/en/nichicon/UZP1C100MCL1GB/493-10077-1-ND/3983922; Device Package: Radial, Can - SMD; Height - Seated (Max): 0.181" (4.60mm); lastupdated: 9/2/2020 1:18:30 AM; Lifecycle Status: Active; Minimum Order: 1; Mounting Type: Surface Mount; Operating Temperature: -40°C ~ 85°C; Package / Case: Radial, Can - SMD; packaging: TapeAndReel; partid: 8608; Part Status: Active; price: 0.21; series: UZP; Size / Dimension: 0.197" Dia (5.00mm); Supplier 1: DigiKey; Supplier Part Number 1: 493-10077-1-ND; Tolerance: ±20%; value: 10µF; Voltage - Rated: 16V
CN8 = 6339191-1: Connector; Manufacturer_Name: TE Connectivity; Datasheet Link: http://www.te.com/commerce/DocumentDelivery/DDEController?Action=srchrtrv&DocNm=6339191&DocType=Customer+Drawing&DocLang=English&DocFormat=pdf&PartCntxt=6339191-1; Height: 14.91mm; Manufacturer_Part_Number: 6339191-1; Mouser Part Number: 571-6339191-1; Mouser Price/Stock: https://www.mouser.co.uk/ProductDetail/TE-Connectivity-AMP/6339191-1?qs=6KRng%2F8lLtNwkkppUOlXgw%3D%3D; Arrow Part Number: 6339191-1; Arrow Price/Stock: https://www.arrow.com/en/products/6339191-1/te-connectivity?region=europe
L1 = Inductor: Value: 100uH; Published: 8-Jun-2000; Revision: July-2002: Re-released for DXP Platform.; Publisher: Altium Limited
R41-R63 = Res1: Resistor; Published: 8-Jun-2000; LatestRevisionDate: 17-Jul-2002; LatestRevisionNote: Re-released for DXP Platform.; PackageReference: AXIAL-0.3; Publisher: Altium Limited; PackageDescription: Axial Device, Thru-Hole; 2 Leads; 0.3 in Pin Spacing
SB10-SB12 = Circuit Breaker: Published: 24-Mar-1999; Revision: July-2002: Re-released for DXP Platform.; Publisher: Altium Limited
U7 = USBLC6-4SC6: Integrated Circuit; Manufacturer_Name: STMicroelectronics; Datasheet Link: http://www.st.com/st-web-ui/static/active/en/resource/technical/document/datasheet/CD00047494.pdf; Height: 1.45mm; Manufacturer_Part_Number: USBLC6-4SC6; Mouser Part Number: 511-USBLC6-4SC6; Mouser Price/Stock: https://www.mouser.co.uk/ProductDetail/STMicroelectronics/USBLC6-4SC6?qs=k9dH%2Fx4GHJCNdehb8zInZg%3D%3D; Arrow Part Number: USBLC6-4SC6; Arrow Price/Stock: https://www.arrow.com/en/products/usblc6-4sc6/stmicroelectronics?region=nac
U8 = LAN8742A-CZ-TR: LAN8742A-CZ-TR - Small Footprint RMII 10/100 Ethernet, Transceiver with HP Auto-MDIX and flexPWR Technology SQFN-24; Manuf_1: MICROCHIP; Order: LAN8742A-CZ-TR; Manuf_Part_1: LAN8742A-CZ-TR; Distrib: MICROCHIP
X2 = EB2532JA12-25.000M_TR: Crystal or Oscillator; Manufacturer_Name: Ecliptek; Manufacturer_Part_Number: EB2532JA12-25.000M TR; Datasheet Link: https://componentsearchengine.com/Datasheets/1/EB2532JA12-25.000M TR.pdf; Height: 0.8mm; Mouser Part Number: 669-EB2532JA12-25T; Mouser Price/Stock: https://www.mouser.com/Search/Refine.aspx?Keyword=669-EB2532JA12-25T; Arrow Part Number: EB2532JA12-25.000M TR; Arrow Price/Stock: https://www.arrow.com/en/products/eb2532ja12-25.000m-tr/ecliptek

## Sheet WiFi.SchDoc
size B
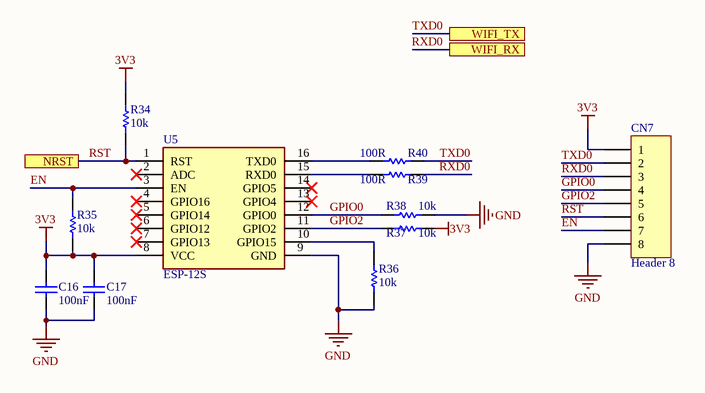
[diagram p5: WiFi.SchDoc]

### Parts
C16  value 100nF  [1608[0603]]  (hidden comment: Cap)
C17  value 100nF  [1608[0603]]  (hidden comment: Cap)
CN7  Header 8  [HDR1X8]
R34  value 10k  [1608[0603]]  (hidden comment: Res1)
R35  value 10k  [1608[0603]]  (hidden comment: Res1)
R36  value 10k  [1608[0603]]  (hidden comment: Res1)
R37  value 10k  [1608[0603]]  (hidden comment: Res1)
R38  value 10k  [1608[0603]]  (hidden comment: Res1)
R39  value 100R  [1608[0603]]  (hidden comment: Res1)
R40  value 100R  [1608[0603]]  (hidden comment: Res1)
U5  ESP-12S  [ESP12S]

### Ports
NRST, WIFI_RX, WIFI_TX

### Nets
3V3: C16.1 C17.1 CN7.1 R34.2 R35.2 R37.2 U5.8(VCC)
GND: C16.2 C17.2 CN7.8 R36.2 R38.2 U5.9(GND)
EN: CN7.7 R35.1 U5.3(EN)
GPIO0: CN7.4 R38.1 U5.12(GPIO0)
GPIO2: CN7.5 R37.1 U5.11(GPIO2)
RST: CN7.6 R34.1 U5.1(RST) ; port NRST  [project net NRST]
RXD0: CN7.3 R39.1 ; port WIFI_RX
TXD0: CN7.2 R40.1 ; port WIFI_TX
NetR36_1: R36.1 U5.10(GPIO15)
NetR39_2: R39.2 U5.15(RXD0)
NetR40_2: R40.2 U5.16(TXD0)

Not connected (* = marked no-connect by the designer): U5 2(ADC)* 4(GPIO16)* 5(GPIO14)* 6(GPIO12)* 7(GPIO13)* 13(GPIO4)* 14(GPIO5)*

### Library data of the parts
C16 C17 = Cap: Capacitor; Published: 8-Jun-2000; LatestRevisionDate: 17-Jul-2002; LatestRevisionNote: Re-released for DXP Platform.; PackageReference: RAD-0.3; Publisher: Altium Limited; PackageDescription: Radial Cap, Thru-Hole; 2 Leads; 0.3 in Pin Spacing
CN7 = Header 8: Header, 8-Pin; LatestRevisionDate: 17-Jul-2002; LatestRevisionNote: Re-released for DXP Platform.; Publisher: Altium Limited
R34-R40 = Res1: Resistor; Published: 8-Jun-2000; LatestRevisionDate: 17-Jul-2002; LatestRevisionNote: Re-released for DXP Platform.; PackageReference: AXIAL-0.3; Publisher: Altium Limited; PackageDescription: Axial Device, Thru-Hole; 2 Leads; 0.3 in Pin Spacing
U5 = ESP-12S: Integrated Circuit; Manufacturer_Name: RF SOLUTIONS; Datasheet Link: https://datasheet.datasheetarchive.com/originals/distributors/DKDS42/DSANUWW0049619.pdf; Height: 3mm; Manufacturer_Part_Number: ESP-12S; Mouser Part Number: 223-ESP-12S; Mouser Price/Stock: https://www.mouser.co.uk/ProductDetail/RF-Solutions/ESP-12S?qs=UkDUCjYnTB27YArJ5wHUxg%3D%3D

## Nets that join several sheets
3V3: Extension_Board (CN9.1), SD (7 pins), USB (R31.2), Ethernet (8 pins), WiFi (7 pins)
GND: Extension_Board (10 pins), STLINK (35 pins), SD (6 pins), USB (6 pins), Ethernet (27 pins), WiFi (6 pins)
FS_DM_N: Extension_Board (CN1.16), USB (CN6.2 U4.1 U4.6)
FS_DM_P: Extension_Board (CN1.17), USB (CN6.3 U4.3 U4.4)
JTCK: Extension_Board (CN1.4), STLINK (SB6.2)
JTMS: Extension_Board (CN1.3), STLINK (SB7.2)
NRST: Extension_Board (B1.2 B1.3 C1.1 CN1.5), STLINK (SB8.2), Ethernet (SB12.1), WiFi (CN7.6 R34.1 U5.1)
RMII_CRS_DV: Extension_Board (CN1.25), Ethernet (R47.2)
RMII_MDC: Extension_Board (CN1.23), Ethernet (U8.13)
RMII_MDIO: Extension_Board (CN1.24), Ethernet (R48.2)
RMII_REF_CLK: Extension_Board (CN1.22), Ethernet (R50.2)
RMII_RXD0: Extension_Board (CN1.27), Ethernet (R44.2)
RMII_RXD1: Extension_Board (CN1.26), Ethernet (R45.2)
RMII_TX_EN: Extension_Board (CN1.21), Ethernet (U8.16)
RMII_TXD0: Extension_Board (CN1.20), Ethernet (U8.17)
RMII_TXD1: Extension_Board (CN1.19), Ethernet (U8.18)
RX: Extension_Board (CN1.2), STLINK (SB3.1 W1.2)
RXD0: Extension_Board (CN1.30), WiFi (CN7.3 R39.1)
SWO: Extension_Board (CN1.6), STLINK (SB9.2)
TX: Extension_Board (CN1.1), STLINK (SB4.1 W1.1)
TXD0: Extension_Board (CN1.29), WiFi (CN7.2 R40.1)
uSD_CLK: Extension_Board (CN1.12), SD (CN2.P5)
uSD_CMD: Extension_Board (CN1.11), SD (CN2.P3 R3.2)
uSD_D0: Extension_Board (CN1.13), SD (CN2.P7 R4.2)
uSD_D1: Extension_Board (CN1.14), SD (CN2.P8 R5.2)
uSD_D2: Extension_Board (CN1.9), SD (CN2.P1 R1.2)
uSD_D3: Extension_Board (CN1.10), SD (CN2.P2 R2.2)
uSD_DETECT: Extension_Board (CN1.8), SD (R6.1 SB1.2)